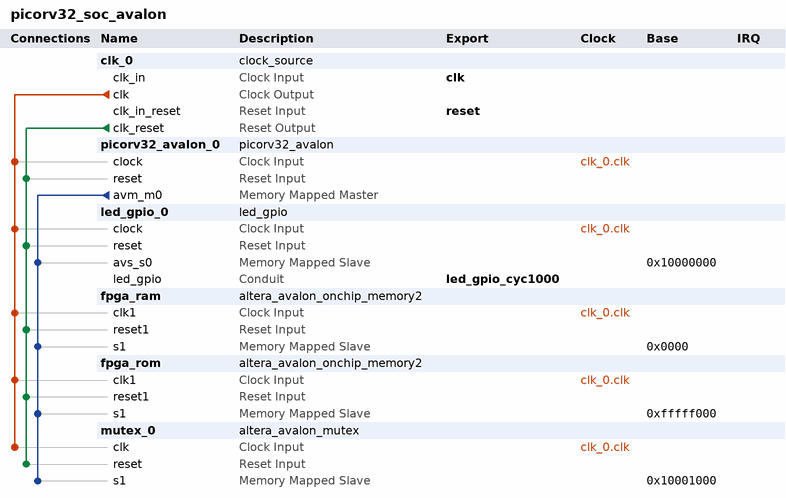
[diagram p0: system contents]
# Platform Designer (Qsys) system picorv32_soc_avalon, Cyclone 10 LP 10CL025YU256C8G
# Parameters at their usual value, and those the tool derives, are not listed.
package require -exact qsys 18.1
create_system picorv32_soc_avalon
set_project_property DEVICE_FAMILY {Cyclone 10 LP}
set_project_property DEVICE 10CL025YU256C8G

add_instance clk_0 clock_source 18.1
set_instance_parameter_value clk_0 clockFrequency 50000000

add_instance picorv32_avalon_0 picorv32_avalon 1.0

add_instance led_gpio_0 led_gpio 1.0

add_instance fpga_ram altera_avalon_onchip_memory2 18.1
set_instance_parameter_value fpga_ram dataWidth 32
set_instance_parameter_value fpga_ram dualPort false
set_instance_parameter_value fpga_ram initMemContent false
set_instance_parameter_value fpga_ram initializationFileName onchip_mem.hex
set_instance_parameter_value fpga_ram memorySize 4096

add_instance fpga_rom altera_avalon_onchip_memory2 18.1
set_instance_parameter_value fpga_rom dataWidth 32
set_instance_parameter_value fpga_rom dualPort false
set_instance_parameter_value fpga_rom initMemContent true
set_instance_parameter_value fpga_rom initializationFileName picorv32_rom.hex
set_instance_parameter_value fpga_rom memorySize 4096
set_instance_parameter_value fpga_rom useNonDefaultInitFile true
set_instance_parameter_value fpga_rom writable false

add_instance mutex_0 altera_avalon_mutex 18.1

# connections
add_connection clk_0.clk fpga_ram.clk1 clock
add_connection clk_0.clk fpga_rom.clk1 clock
add_connection clk_0.clk led_gpio_0.clock clock
add_connection clk_0.clk mutex_0.clk clock
add_connection clk_0.clk picorv32_avalon_0.clock clock
add_connection clk_0.clk_reset fpga_ram.reset1 reset
add_connection clk_0.clk_reset fpga_rom.reset1 reset
add_connection clk_0.clk_reset led_gpio_0.reset reset
add_connection clk_0.clk_reset mutex_0.reset reset
add_connection clk_0.clk_reset picorv32_avalon_0.reset reset
add_connection picorv32_avalon_0.avm_m0 fpga_ram.s1 avalon
set_connection_parameter_value picorv32_avalon_0.avm_m0/fpga_ram.s1 baseAddress 0x0000
add_connection picorv32_avalon_0.avm_m0 fpga_rom.s1 avalon
set_connection_parameter_value picorv32_avalon_0.avm_m0/fpga_rom.s1 baseAddress 0xfffff000
add_connection picorv32_avalon_0.avm_m0 led_gpio_0.avs_s0 avalon
set_connection_parameter_value picorv32_avalon_0.avm_m0/led_gpio_0.avs_s0 baseAddress 0x10000000
add_connection picorv32_avalon_0.avm_m0 mutex_0.s1 avalon
set_connection_parameter_value picorv32_avalon_0.avm_m0/mutex_0.s1 baseAddress 0x10001000

# exported interfaces
add_interface clk clock sink
set_interface_property clk EXPORT_OF clk_0.clk_in
add_interface led_gpio_cyc1000 conduit end
set_interface_property led_gpio_cyc1000 EXPORT_OF led_gpio_0.led_gpio
add_interface reset reset sink
set_interface_property reset EXPORT_OF clk_0.clk_in_reset

set_interconnect_requirement {$system} qsys_mm.clockCrossingAdapter HANDSHAKE
set_interconnect_requirement {$system} qsys_mm.enableEccProtection FALSE
set_interconnect_requirement {$system} qsys_mm.insertDefaultSlave FALSE
set_interconnect_requirement {$system} qsys_mm.maxAdditionalLatency 1

save_system picorv32_soc_avalon.qsys
